# EAGLE design NovsSMTBlinkyRevD (EAGLE 7.5.0)
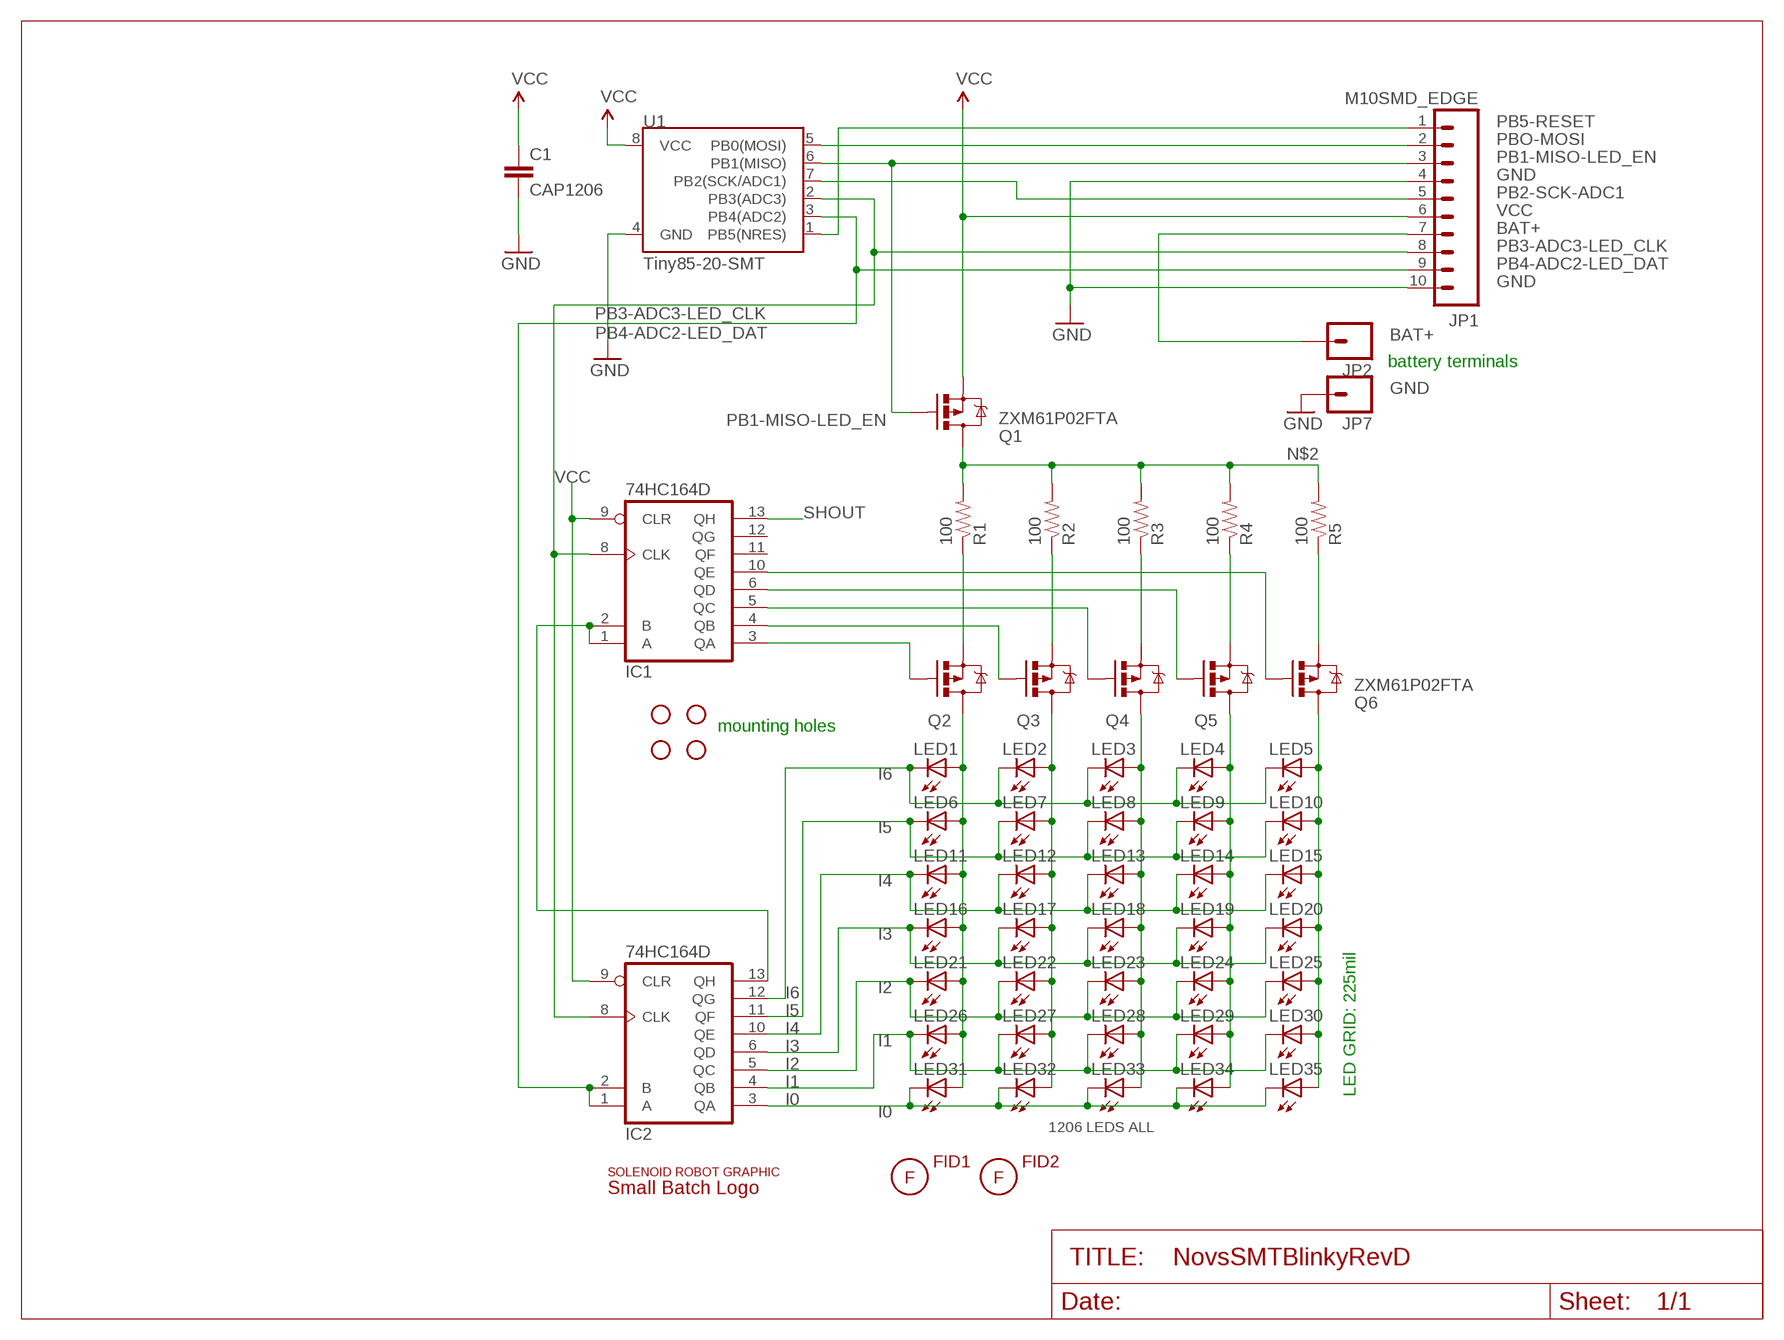
[diagram p0: schematic, sheet 1]

## Parts
C1  CAP1206  [1206]
FID1  FIDUCIAL  [FID05MM]
FID2  FIDUCIAL  [FID05MM]
IC1  74HC164D  [SO14]
IC2  74HC164D  [SO14]
JP1  M10SMD_EDGE  [1X10_SMD_EDGE]
JP2  M01NOSILK-KIT  [1X01NS-KIT]
JP3  MTGHOLE110MIL  [HOLE112]
JP4  MTGHOLE110MIL  [HOLE112]
JP5  MTGHOLE110MIL  [HOLE112]
JP6  MTGHOLE110MIL  [HOLE112]
JP7  M01NOSILK-KIT  [1X01NS-KIT]
LED1  LED1206  [LED-1206]
LED2  LED1206  [LED-1206]
LED3  LED1206  [LED-1206]
LED4  LED1206  [LED-1206]
LED5  LED1206  [LED-1206]
LED6  LED1206  [LED-1206]
LED7  LED1206  [LED-1206]
LED8  LED1206  [LED-1206]
LED9  LED1206  [LED-1206]
LED10  LED1206  [LED-1206]
LED11  LED1206  [LED-1206]
LED12  LED1206  [LED-1206]
LED13  LED1206  [LED-1206]
LED14  LED1206  [LED-1206]
LED15  LED1206  [LED-1206]
LED16  LED1206  [LED-1206]
LED17  LED1206  [LED-1206]
LED18  LED1206  [LED-1206]
LED19  LED1206  [LED-1206]
LED20  LED1206  [LED-1206]
LED21  LED1206  [LED-1206]
LED22  LED1206  [LED-1206]
LED23  LED1206  [LED-1206]
LED24  LED1206  [LED-1206]
LED25  LED1206  [LED-1206]
LED26  LED1206  [LED-1206]
LED27  LED1206  [LED-1206]
LED28  LED1206  [LED-1206]
LED29  LED1206  [LED-1206]
LED30  LED1206  [LED-1206]
LED31  LED1206  [LED-1206]
LED32  LED1206  [LED-1206]
LED33  LED1206  [LED-1206]
LED34  LED1206  [LED-1206]
LED35  LED1206  [LED-1206]
Q1  ZXM61P02FTA  MOSFET-PCHANNELSMD  [SOT23-3]
Q2  MOSFET-PCHANNELSMD  [SOT23-3]
Q3  MOSFET-PCHANNELSMD  [SOT23-3]
Q4  MOSFET-PCHANNELSMD  [SOT23-3]
Q5  MOSFET-PCHANNELSMD  [SOT23-3]
Q6  ZXM61P02FTA  MOSFET-PCHANNELSMD  [SOT23-3]
R1  100  RES1206  [1206]
R2  100  RES1206  [1206]
R3  100  RES1206  [1206]
R4  100  RES1206  [1206]
R5  100  RES1206  [1206]
U1  Tiny85-20-SMT  ATTINY45TINY85-20-SMT  [SO08-EIAJ]
U$1  SOLENOID_ROBOT  [SOLENOID_ROBT_450MIL]
U$4  SMALLBATCH_LOGO750W  [SMALLBATCH_750W]

## Nets
BAT+: JP1.7 JP2.1
GND: C1.2 JP1.4 JP1.10 JP7.1 U1.4(GND)
I0: IC2.3(QA) LED31.C LED32.C LED33.C LED34.C LED35.C
I1: IC2.4(QB) LED26.C LED27.C LED28.C LED29.C LED30.C
I2: IC2.5(QC) LED21.C LED22.C LED23.C LED24.C LED25.C
I3: IC2.6(QD) LED16.C LED17.C LED18.C LED19.C LED20.C
I4: IC2.10(QE) LED11.C LED12.C LED13.C LED14.C LED15.C
I5: IC2.11(QF) LED6.C LED7.C LED8.C LED9.C LED10.C
I6: IC2.12(QG) LED1.C LED2.C LED3.C LED4.C LED5.C
N$1: IC1.1(A) IC1.2(B) IC2.13(QH)
N$2: Q1.3(D) R1.2 R2.2 R3.2 R4.2 R5.2
N$8: LED1.A LED6.A LED11.A LED16.A LED21.A LED26.A LED31.A Q2.3(D)
N$9: LED2.A LED7.A LED12.A LED17.A LED22.A LED27.A LED32.A Q3.3(D)
N$11: LED4.A LED9.A LED14.A LED19.A LED24.A LED29.A LED34.A Q5.3(D)
N$12: LED5.A LED10.A LED15.A LED20.A LED25.A LED30.A LED35.A Q6.3(D)
N$13: LED3.A LED8.A LED13.A LED18.A LED23.A LED28.A LED33.A Q4.3(D)
N$15: Q2.2(S) R1.1
N$16: Q3.2(S) R2.1
N$18: Q4.2(S) R3.1
N$19: Q5.2(S) R4.1
N$20: Q6.2(S) R5.1
N$21: IC1.3(QA) Q2.1(G)
N$22: IC1.4(QB) Q3.1(G)
N$23: IC1.5(QC) Q4.1(G)
N$24: IC1.6(QD) Q5.1(G)
N$25: IC1.10(QE) Q6.1(G)
PB1-MISO-LED_EN: JP1.3 Q1.1(G) U1.6(PB1(MISO))
PB2-SCK-ADC1: JP1.5 U1.7(PB2(SCK/ADC1))
PB3-ADC3-LED_CLK: IC1.8(CLK) IC2.8(CLK) JP1.8 U1.2(PB3(ADC3))
PB4-ADC2-LED_DAT: IC2.1(A) IC2.2(B) JP1.9 U1.3(PB4(ADC2))
PB5-RESET: JP1.1 U1.1(PB5(NRES))
PBO-MOSI: JP1.2 U1.5(PB0(MOSI))
SHOUT: IC1.13(QH)
VCC: C1.1 IC1.9(CLR) IC2.9(CLR) JP1.6 Q1.2(S) U1.8(VCC)
Unconnected: IC1.11(QF) IC1.12(QG)

## Notes on the sheet
- battery terminals
- mounting holes
- LED GRID: 225mil
- 1206 LEDS ALL

## Power pins joined to a net without a drawn wire
GND: IC1.7(GND) IC2.7(GND)
VCC: IC1.14(VCC) IC2.14(VCC)

## Library data of the parts
C1 = NovaEagleCADCLass:CAP1206
FID1 FID2 = _cogwheel:FIDUCIAL
IC1 IC2 = 74xx-us:74*164: 8-bit parallel out SHIFT REGISTER
JP1 = _cogwheel:M10: Header 10 Standard 10-pin 0.1" header. Use with straight break away headers (SKU : PRT-00116), right angle break away headers (PRT-00553), swiss pins (PRT-00743), machine pins (PRT-00117), and female headers (PRT-00115).
JP2 JP7 = SparkFun-Connectors:M01: Header 1 Standard 1-pin 0.1" header. Use with straight break away headers (SKU : PRT-00116), right angle break away headers (PRT-00553), swiss pins (PRT-00743), machine pins (PRT-00117), and female headers (PRT-00115).
JP3-JP6 = _cogwheel:MTGHOLE110MIL: Stand Off This is the mechanical footprint for a #4 phillips button head screw. Use the keepout ring to avoid running the screw head into surrounding components. SKU : PRT-00447
LED1-LED35 = NovaEagleCADCLass:LED: LEDs Standard schematic elements and footprints for 5mm, 3mm, 1206, and 0603 sized LEDs. 5mm - Spark Fun Electronics SKU : COM-00529 (and others)
Q1-Q6 = SparkFun-DiscreteSemi:MOSFET-PCHANNEL: Generic PMOSFET
R1-R5 = NovaEagleCADCLass:RES1206
U1 = NovaEagleCADCLass:ATTINY45: Atmel 8-pin 2/4/8kB flash uC; PROD_ID: IC-09092
U$1 = _cogwheel:SOLENOID_ROBOT
U$4 = _cogwheel:SMALLBATCH_LOGO

## Net classes
0 default: width 0.178 mm

## Board
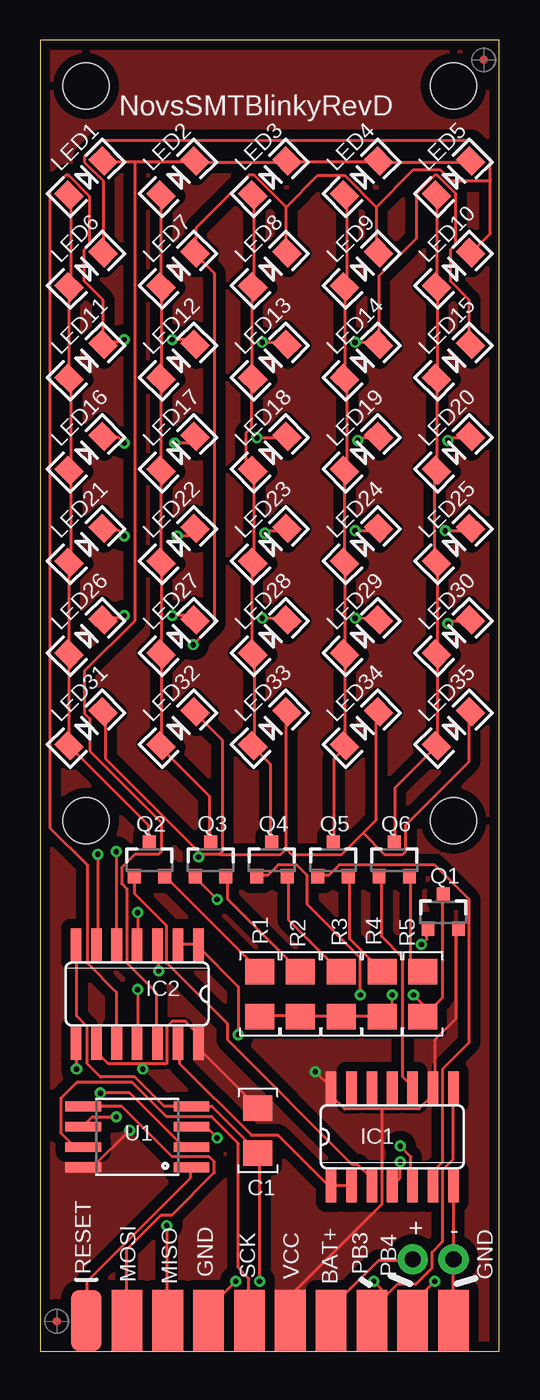
[diagram p1: board, top side]
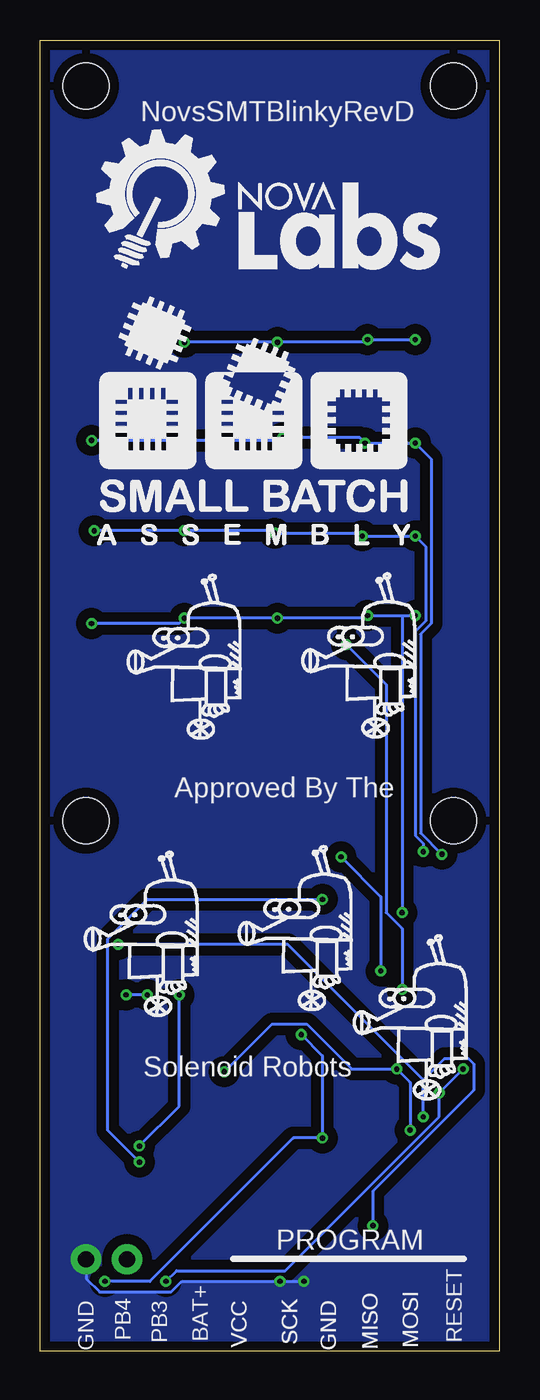
[diagram p2: board, bottom side, seen from below]

Size 28.58 x 81.6 mm. Coordinates in mm from the lower left corner, seen from the top.
Outline: 0,81.6 0,0 28.58,0 28.58,81.6 0,81.6
Copper layers (1*16): Top 0.0356mm / dielectric 1.5011mm / Bottom 0.0356mm
Design rules "LaenPCBOrder *": minimum track width 6mil, minimum drill 13mil, track to track 6mil, track to pad 6mil, pad to pad 6mil, via to via 6mil, smd to smd 6mil, copper to edge 15mil, drill to drill 6mil, minimum pad ring 7mil, minimum via ring 7mil, stop-mask expansion 3mil, vias tented up to drill 20mil, thermal gap 10mil

### Footprints (pad centres in the part's own frame; a part is rotated, then mirrored left to right if it is on the bottom)
1206 = smd 1.6 x 1.8: 1 -1.4,0; 2 1.4,0
SO14 = smd 0.66 x 2.032: 1 -3.81,-3.073; 2 -2.54,-3.073; 3 -1.27,-3.073; 4 0,-3.073; 5 1.27,-3.073; 6 2.54,-3.073; 7 3.81,-3.073; 8 3.81,3.073; 9 2.54,3.073; 10 1.27,3.073; 11 0,3.073; 12 -1.27,3.073; 13 -2.54,3.073; 14 -3.81,3.073
1X10_SMD_EDGE = smd 1.905 x 3.81: 1 -11.43,0; 2 -8.89,0; 3 -6.35,0; 4 -3.81,0; 5 -1.27,0; 6 1.27,0; 7 3.81,0; 8 6.35,0; 9 8.89,0; 10 11.43,0
1X01NS-KIT = drill 1.016 pad 1.88: 1 0,0
HOLE112 = hole 2.857: 0,0
LED-1206 = smd 1.2 x 1.4: A -1.5,0; C 1.5,0
SOT23-3 = smd 0.8 x 0.9: 1 -0.95,-1; 2 0.95,-1; 3 0,1.1
SO08-EIAJ = smd 0.61 x 2.21: 1 -1.905,-3.378; 2 -0.635,-3.378; 3 0.635,-3.378; 4 1.905,-3.378; 5 1.905,3.353; 6 0.635,3.353; 7 -0.635,3.353; 8 -1.905,3.353

### Placement (x,y rotation side)
C1  13.55,13.72 270 top
FID1  1.03,1.85 0 top
FID2  27.6,80.37 0 top
IC1  21.91,13.34 0 top
IC2  6.03,22.23 180 top
JP1  14.29,1.9 0 top
JP2  23.18,5.71 0 top
JP3  2.86,33.02 90 top
JP4  2.86,78.74 90 top
JP5  25.72,33.02 90 top
JP6  25.72,78.74 90 top
JP7  25.72,5.71 0 top
LED1  2.86,73.03 45 top
LED2  8.57,73.03 45 top
LED3  14.29,73.03 45 top
LED4  20,73.03 45 top
LED5  25.72,73.03 45 top
LED6  2.86,67.31 45 top
LED7  8.57,67.31 45 top
LED8  14.29,67.31 45 top
LED9  20,67.31 45 top
LED10  25.72,67.31 45 top
LED11  2.86,61.59 45 top
LED12  8.57,61.59 45 top
LED13  14.29,61.59 45 top
LED14  20,61.59 45 top
LED15  25.72,61.59 45 top
LED16  2.86,55.88 45 top
LED17  8.57,55.88 45 top
LED18  14.29,55.88 45 top
LED19  20,55.88 45 top
LED20  25.72,55.88 45 top
LED21  2.86,50.16 45 top
LED22  8.57,50.16 45 top
LED23  14.29,50.16 45 top
LED24  20,50.16 45 top
LED25  25.72,50.16 45 top
LED26  2.86,44.45 45 top
LED27  8.57,44.45 45 top
LED28  14.29,44.45 45 top
LED29  20,44.45 45 top
LED30  25.72,44.45 45 top
LED31  2.86,38.73 45 top
LED32  8.57,38.73 45 top
LED33  14.29,38.73 45 top
LED34  20,38.73 45 top
LED35  25.72,38.73 45 top
Q1  25.08,27.3 0 top
Q2  6.79,30.56 0 top
Q3  10.6,30.56 0 top
Q4  14.41,30.56 0 top
Q5  18.22,30.56 0 top
Q6  22.03,30.56 0 top
R1  13.65,22.23 270 top
R2  16.19,22.23 270 top
R3  18.73,22.23 270 top
R4  21.27,22.23 270 top
R5  23.81,22.23 270 top
U1  6.03,13.34 90 top
U$1  25.95,20.6 0 bottom
U$2  [NOVA-LABS-LOGO-FULL-SMALL]  25.08,67.31 0 bottom
U$3  SOLENOID_ROBOT  [SOLENOID_ROBT_450MIL]  9.21,15.39 0 bottom
U$4  25.08,50.16 0 bottom
U$5  SOLENOID_ROBOT  [SOLENOID_ROBT_450MIL]  16.37,20.96 0 bottom
U$6  SOLENOID_ROBOT  [SOLENOID_ROBT_450MIL]  23.28,37.85 0 bottom
U$7  SOLENOID_ROBOT  [SOLENOID_ROBT_450MIL]  12.41,37.92 0 bottom

### Tracks (layer width: path | path; a pad name or v marks a point on that pad's centre or on a via)
BAT+
  Top 0.178: JP2.1 23.06,5.66 21.08,5.66 18.11,2.69 18.11,2.03 JP1.7
GND  (via drill 0.33)
  Top 0.178: IC2.7 2.26,25.15 2.26,20.85 2.92,20.19 2.92,17.88 3.75,17.06 5.89,17.06 7.71,15.24 U1.4 10.68,15.24 13.49,12.43 C1.2 13.65,12.27 v13.65,4.34 | JP1.10 25.7,2.03 25.7,5.66 JP7.1 25.7,5.83 25.7,10.12 IC1.7 | v12.17,4.34 10.52,2.69 10.52,2.03 JP1.4
  Bottom 0.178: v12.17,4.34 v13.65,4.34 19.76,4.34 20.42,3.68 24.88,3.68 25.7,4.51 25.7,5.66 JP7.1
  pour Bottom (isolate 0.61, no thermals): 0,0 28.89,0 28.89,81.28 0,81.28
I0  (via drill 0.33)
  Top 0.178: 10.02,30.92 4.08,36.87 4.08,39.67 LED31.C | 11.18,30.92 10.02,30.92 | 11.18,30.92 11.34,31.09 11.34,38.02 9.69,39.67 LED32.C | 15.3,31.25 15.3,39.67 LED33.C | 15.3,31.25 14.97,30.92 11.18,30.92 | 20.09,32.24 18.77,30.92 15.63,30.92 15.3,31.25 | 20.09,32.24 20.92,33.07 20.92,39.67 LED34.C | 20.09,32.24 21.41,30.92 22.57,30.92 22.73,31.09 22.73,32.74 26.7,36.7 26.7,39.67 LED35.C | v7.38,23.66 7.38,25.15 IC2.3 | 10.02,30.92 v9.86,30.76
  Bottom 0.178: v7.38,23.66 7.38,28.28 v9.86,30.76
I1  (via drill 0.33)
  Top 0.178: v5.23,45.78 5.07,45.62 4.08,45.62 LED26.C | v8.2,45.78 9.36,45.78 9.53,45.62 LED27.C | v13.82,45.62 15.3,45.62 LED28.C | v19.6,45.62 20.92,45.62 LED29.C | v25.37,45.29 25.54,45.45 26.7,45.45 LED30.C | v6.06,27.29 6.06,25.31 IC2.4
  Bottom 0.178: 6.06,45.78 v8.2,45.78 8.37,45.62 v13.82,45.62 v19.6,45.62 19.93,45.29 v25.37,45.29 | 6.06,45.78 v5.23,45.78 | 6.06,45.78 v6.06,27.29
I2  (via drill 0.33)
  Top 0.178: v5.23,50.74 4.9,51.07 4.08,51.07 LED21.C | v8.53,50.74 9.19,50.74 9.53,51.07 LED22.C | v13.98,50.9 14.15,51.07 15.3,51.07 LED23.C | v19.6,51.07 20.92,51.07 LED24.C | v25.21,51.07 26.7,51.07 LED25.C | v4.74,31.09 4.74,25.31 IC2.5
  Bottom 0.178: v25.21,51.07 v19.6,51.07 14.15,51.07 v13.98,50.9 8.7,50.9 v8.53,50.74 v5.23,50.74 4.57,50.08 4.57,45.45 5.23,44.79 5.23,32.08 4.74,31.58 v4.74,31.09
I3  (via drill 0.33)
  Top 0.178: v5.23,56.51 4.9,56.84 4.08,56.84 LED16.C | v8.37,56.51 9.19,56.51 9.53,56.84 LED17.C | v13.49,56.84 15.3,56.84 LED18.C | v19.76,56.68 19.93,56.84 20.92,56.84 LED19.C | v25.37,56.68 25.54,56.84 26.7,56.84 LED20.C | v3.58,30.92 3.58,25.31 IC2.6
  Bottom 0.178: v25.37,56.68 v19.76,56.68 13.65,56.68 v13.49,56.84 8.7,56.84 v8.37,56.51 v5.23,56.51 4.24,55.52 4.24,45.29 4.9,44.63 4.9,32.24 v3.58,30.92
I4  (via drill 0.33)
  Top 0.178: LED15.C 26.7,62.79 26.7,65.43 25.54,66.59 25.54,68.57 25.87,68.9 25.87,72.03 24.71,73.19 24.55,73.19 23.39,72.03 23.39,69.23 21.08,66.92 21.08,62.79 LED14.C 20.92,62.79 v19.6,62.79 | v5.23,62.95 5.07,62.79 4.08,62.79 LED11.C 3.91,62.79 3.91,65.43 2.76,66.59 2.76,68.57 3.09,68.9 3.09,71.87 1.77,73.19 1.6,73.19 0.61,72.2 0.61,32.58 2.92,30.26 2.92,24.16 4.74,22.34 4.74,19.2 IC2.10 | v8.2,62.95 9.36,62.95 9.53,62.79 LED12.C | v13.82,62.79 15.3,62.79 LED13.C
  Bottom 0.178: v5.23,62.95 v8.2,62.95 8.37,62.79 v13.82,62.79 v19.6,62.79
I5  (via drill 0.33)
  Top 0.178: 28.02,72.86 28.02,69.56 26.86,68.4 LED10.C | 28.02,72.86 28.02,74.18 26.86,75.34 3.75,75.34 2.76,74.35 2.76,74.02 3.91,72.86 3.91,68.4 LED6.C | 15.3,71.21 13.32,73.19 12.99,73.19 9.69,69.89 9.69,68.4 LED7.C 9.69,68.24 10.85,67.08 10.85,45.29 v9.53,43.97 | 15.3,71.21 15.3,68.4 LED8.C | 20.92,71.21 20.92,68.4 LED9.C | 20.92,71.21 18.94,73.19 17.28,73.19 15.3,71.21 | v6.06,22.5 6.06,19.2 IC2.11 | 28.02,72.86 25.54,72.86 24.88,73.52 23.23,73.52 20.92,71.21
  Bottom 0.178: v6.06,22.5 6.06,26.3 7.05,27.29 7.05,41.49 v9.53,43.97
I6
  Top 0.178: LED5.C 26.7,74.02 21.08,74.02 LED4.C 20.92,74.02 15.47,74.02 LED3.C 15.3,74.02 9.69,74.02 LED2.C 9.53,74.02 5.89,74.02 | 5.89,74.02 4.08,74.02 LED1.C | 5.89,74.02 5.89,45.45 2.76,42.32 2.76,39.67 3.09,39.34 3.09,37.36 7.54,32.91 7.54,31.09 7.38,30.92 5.89,30.92 5.07,30.1 5.07,29.11 5.4,28.78 5.4,24.16 7.21,22.34 7.21,19.2 IC2.12
N$1
  Top 0.178: IC1.2 19.27,10.29 18.11,10.29 IC1.1 17.95,10.29 14.81,13.42 13.16,13.42 8.7,17.88 8.7,19.04 IC2.13
N$2  (via drill 0.33)
  Top 0.178: 24.22,21.18 23.89,20.85 R5.2 24.22,21.18 | 24.22,21.18 25.04,22.01 25.04,28.28 Q1.3 | R1.2 13.65,20.85 16.13,20.85 R2.2 16.29,20.85 18.61,20.85 R3.2 18.77,20.85 21.25,20.85 R4.2 21.41,20.85 21.91,21.35 v21.91,22.17 | v23.23,22.17 24.22,21.18
  Bottom 0.178: v21.91,22.17 v23.23,22.17
N$8
  Top 0.178: LED1.A 1.93,71.87 1.93,66.26 LED6.A 1.77,66.09 1.77,60.64 LED11.A 1.93,60.48 1.93,54.86 LED16.A 1.93,54.7 1.93,49.25 LED21.A 1.77,49.08 1.77,43.47 LED26.A 1.77,43.31 1.77,37.69 LED31.A 1.93,37.53 6.72,32.74 6.72,31.75 Q2.3
N$9
  Top 0.178: LED2.A 7.54,71.87 7.54,66.26 LED7.A 7.54,66.09 7.54,60.64 LED12.A 7.54,60.48 7.54,54.86 LED17.A 7.54,54.7 7.54,49.25 LED22.A 7.54,49.08 7.54,43.47 LED27.A 7.54,43.31 7.54,37.69 LED32.A 7.54,37.53 10.52,34.56 10.52,31.75 Q3.3
N$11
  Top 0.178: LED4.A 19.1,71.87 19.1,66.26 LED9.A 18.94,66.09 18.94,60.64 LED14.A 19.1,60.48 19.1,54.86 LED19.A 18.94,54.7 18.94,49.25 LED24.A 18.94,49.08 18.94,43.47 LED29.A 18.94,43.31 18.94,37.69 LED34.A 18.94,37.53 18.28,36.87 18.28,31.75 Q5.3
N$12
  Top 0.178: LED5.A 24.71,71.87 24.71,66.26 LED10.A 24.71,66.09 24.71,60.64 LED15.A 24.71,60.48 24.71,54.86 LED20.A 24.55,54.7 24.55,49.25 LED25.A 24.71,49.08 24.71,43.47 LED30.A 24.71,43.31 24.71,37.69 LED35.A 24.55,37.53 22.07,35.05 22.07,31.75 Q6.3
N$13
  Top 0.178: LED3.A 13.32,71.87 13.32,66.26 LED8.A 13.16,66.09 13.16,60.64 LED13.A 13.16,60.48 13.16,57.51 12.83,57.17 12.83,55.19 13.16,54.86 LED18.A 13.32,54.7 13.32,49.25 LED23.A 13.16,49.08 13.16,43.47 LED28.A 13.32,43.31 13.32,37.69 LED33.A 13.32,37.53 14.31,36.54 14.31,31.75 Q4.3
N$15
  Top 0.178: Q2.2 7.87,29.44 13.65,23.66 R1.1
N$16
  Top 0.178: Q3.2 11.67,29.44 11.67,28.12 16.13,23.66 R2.1
N$18
  Top 0.178: Q4.2 15.47,29.44 15.47,26.8 18.61,23.66 R3.1
N$19
  Top 0.178: Q5.2 19.27,29.44 19.27,25.64 21.25,23.66 R4.1
N$20
  Top 0.178: Q6.2 23.06,29.44 23.06,24.32 23.72,23.66 R5.1
N$21
  Top 0.178: Q2.1 5.89,29.44 5.89,28.45 7.87,26.47 7.87,24.16 11.67,20.36 11.67,19.37 19.43,11.61 19.76,11.61 20.59,10.78 20.59,10.29 IC1.3
N$22  (via drill 0.33)
  Top 0.178: v11.01,28.12 9.69,29.44 Q3.1 | v22.4,11.77 22.4,10.78 21.91,10.29 IC1.4
  Bottom 0.178: v11.01,28.12 21.91,28.12 24.38,25.64 24.38,13.75 v22.4,11.77
N$23  (via drill 0.33)
  Top 0.178: v19.93,22.17 19.93,24.49 16.62,27.79 16.62,29.6 15.96,30.26 14.81,30.26 14.15,29.6 13.49,29.6 Q4.1 | v22.4,12.76 23.06,12.1 23.06,10.29 IC1.5
  Bottom 0.178: v19.93,22.17 19.93,15.24 v22.4,12.76
N$24
  Top 0.178: Q5.1 17.28,29.6 17.95,29.6 18.61,30.26 24.55,30.26 26.7,28.12 26.7,19.2 25.04,17.55 25.04,11.77 24.55,11.28 24.55,10.29 IC1.6
N$25
  Top 0.178: Q6.1 21.25,29.44 21.25,25.81 22.57,24.49 22.57,17.06 23.06,16.56 IC1.10
PB1-MISO-LED_EN  (via drill 0.33)
  Top 0.178: v23.72,25.31 24.05,25.64 24.05,26.3 Q1.1 | v4.74,14.58 3.25,14.58 2.76,14.08 U1.6 | v7.87,7.81 7.87,2.03 JP1.3
  Bottom 0.178: v23.72,25.31 13.16,25.31 4.74,16.89 | v4.74,14.58 4.74,16.89 | v7.87,7.81 7.87,9.96 1.6,16.23 1.6,17.88 1.93,18.21 3.42,18.21 4.74,16.89
PB2-SCK-ADC1
  Top 0.178: U1.7 2.59,12.76 2.1,12.76 1.27,13.59 1.27,15.73 2.26,16.73 5.73,16.73 7.87,14.58 10.68,14.58 12.33,12.93 12.33,5.17 12.99,4.51 12.99,2.03 JP1.5
PB3-ADC3-LED_CLK  (via drill 0.33)
  Top 0.178: v2.26,17.55 2.26,19.04 IC2.8 | v3.75,16.07 5.56,16.07 8.86,12.76 9.36,12.76 U1.2 | 21.58,3.52 20.75,2.69 20.75,2.03 JP1.8 21.58,3.52 | 21.58,3.52 22.24,4.18 23.39,4.18 24.38,5.17 24.38,6.16 25.04,6.82 25.04,11.28 25.7,11.94 25.7,16.4 IC1.8 | 21.58,3.52 v20.75,4.34
  Bottom 0.178: v2.26,17.55 v3.75,16.07 3.75,14.58 13.32,5 20.09,5 v20.75,4.34
PB4-ADC2-LED_DAT  (via drill 0.33)
  Top 0.178: IC2.2 8.7,25.31 9.69,25.31 IC2.1 9.86,25.15 12.33,22.67 v12.33,19.7 | v11.01,13.26 10.35,13.92 9.53,13.92 U1.3 | v24.55,4.34 23.23,3.02 23.23,2.03 JP1.9
  Bottom 0.178: v12.33,19.7 11.01,18.38 v11.01,13.26 12.83,13.26 21.74,4.34 v24.55,4.34
PB5-RESET
  Top 0.178: U1.1 9.36,11.28 9.36,10.78 2.92,4.34 2.92,2.03 JP1.1
PBO-MOSI
  Top 0.178: U1.5 5.07,15.24 8.2,12.1 10.52,12.1 10.85,11.77 10.85,11.11 8.2,8.47 7.54,8.47 5.4,6.32 JP1.2
VCC  (via drill 0.33)
  Top 0.178: C1.1 13.49,15.24 9.69,19.04 IC2.14 9.69,19.2 9.69,19.86 9.03,20.52 8.2,20.52 7.87,20.19 7.87,17.88 6.39,17.88 | 6.39,17.88 4.24,17.88 3.58,18.54 3.58,19.04 IC2.9 | v5.56,13.75 3.25,11.44 2.76,11.44 U1.8 | 6.39,17.88 v6.39,17.55 | 21.25,15.07 23.56,15.07 24.38,15.9 24.38,16.4 IC1.9 24.55,16.56 24.55,19.37 25.87,20.69 25.87,26.3 Q1.2 | 21.25,15.07 18.94,15.07 18.11,15.9 18.11,16.4 IC1.14 v17.12,17.39 | 21.25,15.07 21.25,9.13 15.63,3.52 15.63,2.03 JP1.6
  Bottom 0.178: v5.56,13.75 5.56,16.73 v6.39,17.55 9.19,17.55 12,20.36 14.15,20.36 v17.12,17.39
  pour Top (isolate 0.61, no thermals): -0.32,81.6 -0.32,0 28.58,0 28.89,81.28

### Text on the board
tNames: PB4 | + | - | RESET | MOSI | GND | SCK | VCC | PB3 | GND | MISO | BAT+
bNames: Approved By The | Solenoid Robots | PROGRAM | RESET | MOSI | MOSI | MISO | MISO | SCK | SCK | BAT+ | PB4 | GND | GND | VCC | VCC | PB3 | GND